# Altium project Electrolux_ENV06_387109600_RevA_PCB.PrjPCB (part 2 of 3)

## Sheet LCD.SchDoc
size A4; DocumentNumber: 5; SheetNumber: 5; SheetTotal: 7
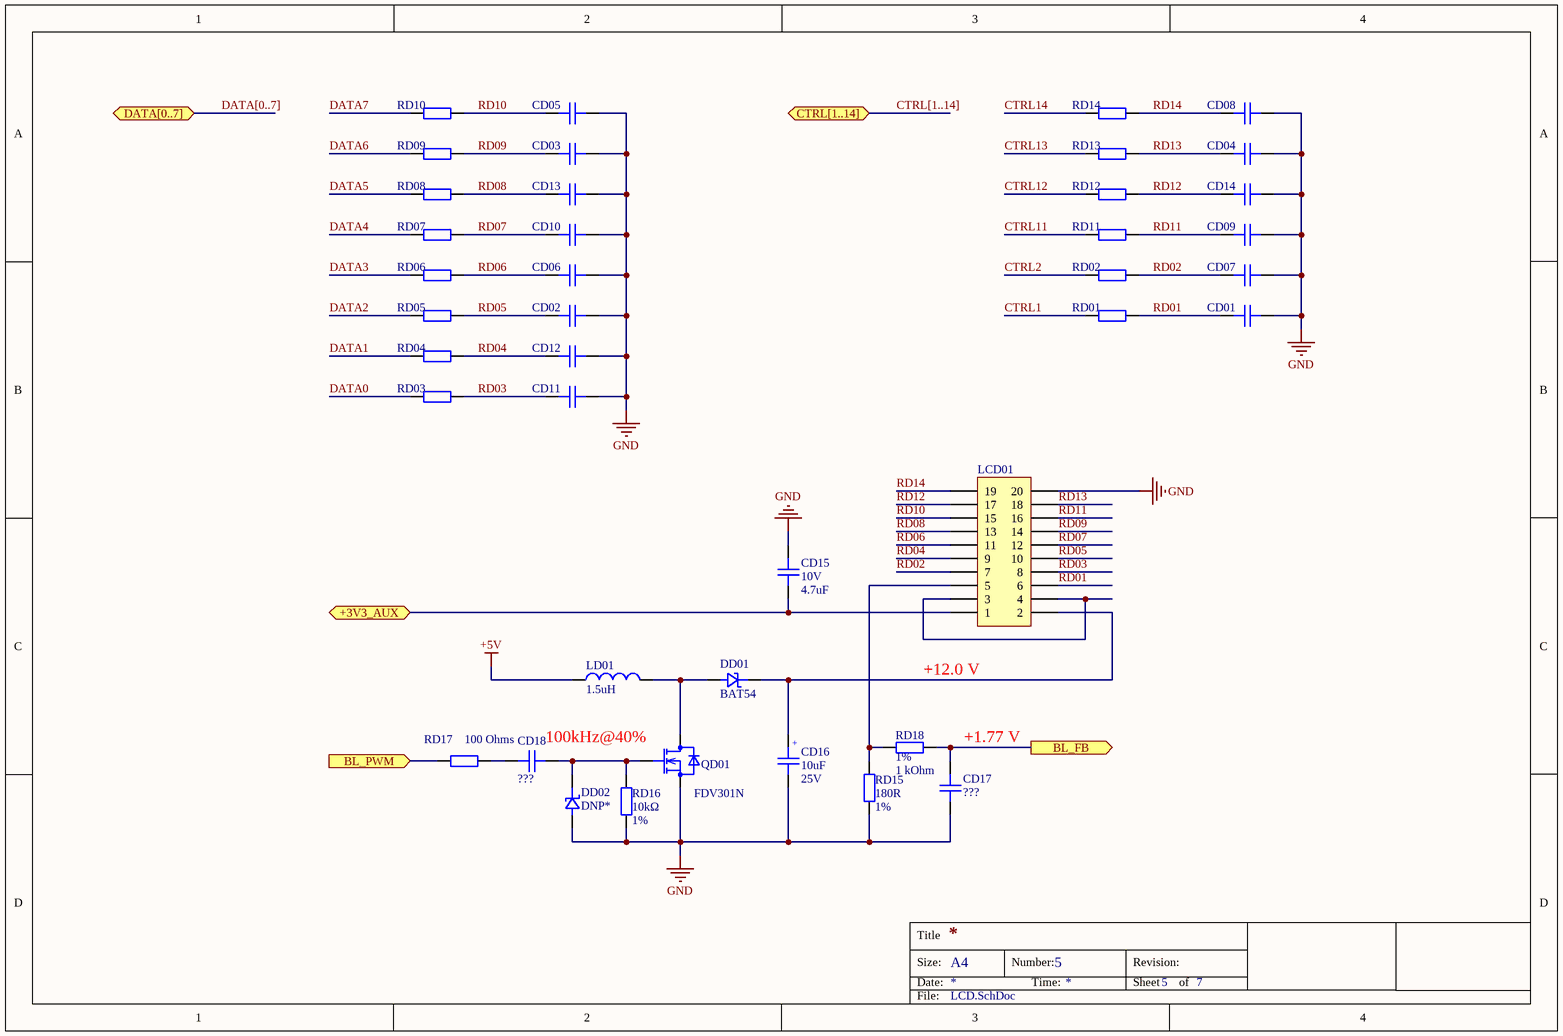
[diagram p3: LCD.SchDoc]

### Parts
CD01  CAP CER 120PF 50V C0G/NP0 0603  [0603C]  (value not drawn)
CD02  CAP CER 120PF 50V C0G/NP0 0603  [0603C]  (value not drawn)
CD03  CAP CER 120PF 50V C0G/NP0 0603  [0603C]  (value not drawn)
CD04  CAP CER 120PF 50V C0G/NP0 0603  [0603C]  (value not drawn)
CD05  CAP CER 120PF 50V C0G/NP0 0603  [0603C]  (value not drawn)
CD06  CAP CER 120PF 50V C0G/NP0 0603  [0603C]  (value not drawn)
CD07  CAP CER 120PF 50V C0G/NP0 0603  [0603C]  (value not drawn)
CD08  CAP CER 120PF 50V C0G/NP0 0603  [0603C]  (value not drawn)
CD09  CAP CER 120PF 50V C0G/NP0 0603  [0603C]  (value not drawn)
CD10  CAP CER 120PF 50V C0G/NP0 0603  [0603C]  (value not drawn)
CD11  CAP CER 120PF 50V C0G/NP0 0603  [0603C]  (value not drawn)
CD12  CAP CER 120PF 50V C0G/NP0 0603  [0603C]  (value not drawn)
CD13  CAP CER 120PF 50V C0G/NP0 0603  [0603C]  (value not drawn)
CD14  CAP CER 120PF 50V C0G/NP0 0603  [0603C]  (value not drawn)
CD15  Voltage Rating: 10V  Capacitance: 4.7uF  [0603C]  (hidden comment: CAP CER 4.7UF 10V X5R 0603)
CD16  Capacitance: 10uF  Rated Voltage: 25V  [WCAP-ASLI_6.3x5.5]  (hidden comment: CAP ALUM 68 UF 20% 25 V SMD)
CD17  Capacitance: ???  [CAPC1608X08N_0603]  (hidden comment: CAP CER 0.1uF ±10% 50V X7R 0603)
CD18  Capacitance: ???  [CAPC1608X08N_0603]  (hidden comment: CAP CER 0.1uF ±10% 50V X7R 0603)
DD01  BAT54  [SOT100P240X120-3N]
DD02  DNP*  [SOT100P240X120-3N]
LCD01  CONN HEADER SMD 20POS 2.54MM  [IDC_2X10 SMD]  (value not drawn)
LD01  Inductance: 1.5uH  (hidden comment: FIXED IND 1.5UH 6.2A 20 MOHM SMD)
QD01  FDV301N  [SOT-23/3]
RD01  100 Ohms  [R_0603]  (value not drawn)
RD02  100 Ohms  [R_0603]  (value not drawn)
RD03  100 Ohms  [R_0603]  (value not drawn)
RD04  100 Ohms  [R_0603]  (value not drawn)
RD05  100 Ohms  [R_0603]  (value not drawn)
RD06  100 Ohms  [R_0603]  (value not drawn)
RD07  100 Ohms  [R_0603]  (value not drawn)
RD08  100 Ohms  [R_0603]  (value not drawn)
RD09  100 Ohms  [R_0603]  (value not drawn)
RD10  100 Ohms  [R_0603]  (value not drawn)
RD11  100 Ohms  [R_0603]  (value not drawn)
RD12  100 Ohms  [R_0603]  (value not drawn)
RD13  100 Ohms  [R_0603]  (value not drawn)
RD14  100 Ohms  [R_0603]  (value not drawn)
RD15  Resistance: 180R  Tolerance: 1%  [Resistor-0603]  (hidden comment: R 180Ω ±5% 0603 0.1W)
RD16  Resistance: 10kΩ  Tolerance: 1%  [R0603]  (hidden comment: RES SMD 10K OHM 1% 1/10W 0603)
RD17  100 Ohms  [R_0603]
RD18  Tolerance: 1%  Resistance: 1 kOhm  [R0603]  (hidden comment: 1 kOhms ±1% 0.1W, 1/10W Chip Resistor 0603 (1608 Metric) Moisture Resistant Thick Film)  (no BOM)

### Ports
+3V3_AUX, BL_FB (out), BL_PWM (in), CTRL[1..14], DATA[0..7]

### Nets
+3V3_AUX: CD15.2 LCD01.1 ; port +3V3_AUX
+5V: LD01.1
GND: CD01.2 CD02.2 CD03.2 CD04.2 CD05.2 CD06.2 CD07.2 CD08.2 CD09.2 CD10.2 CD11.2 CD12.2 CD13.2 CD14.2 CD15.1 CD16.2 CD17.2 DD02.1 LCD01.20 QD01.2(S) RD15.1 RD16.1
CTRL1: RD01.1
CTRL2: RD02.2
CTRL11: RD11.1
CTRL12: RD12.2
CTRL13: RD13.1
CTRL14: RD14.2
DATA0: RD03.1
DATA1: RD04.2
DATA2: RD05.1
DATA3: RD06.2
DATA4: RD07.1
DATA5: RD08.2
DATA6: RD09.1
DATA7: RD10.2
RD01: CD01.1 LCD01.6 RD01.2
RD02: CD07.1 LCD01.7 RD02.1
RD03: CD11.1 LCD01.8 RD03.2
RD04: CD12.1 LCD01.9 RD04.1
RD05: CD02.1 LCD01.10 RD05.2
RD06: CD06.1 LCD01.11 RD06.1
RD07: CD10.1 LCD01.12 RD07.2
RD08: CD13.1 LCD01.13 RD08.1
RD09: CD03.1 LCD01.14 RD09.2
RD10: CD05.1 LCD01.15 RD10.1
RD11: CD09.1 LCD01.16 RD11.2
RD12: CD14.1 LCD01.17 RD12.1
RD13: CD04.1 LCD01.18 RD13.2
RD14: CD08.1 LCD01.19 RD14.1
NetCD16_1: CD16.1 DD01.3 LCD01.2
NetCD17_1: CD17.1 RD18.2 ; port BL_FB
NetCD18_1: CD18.1 DD02.3 QD01.1(G) RD16.2
NetCD18_2: CD18.2 RD17.1
NetDD01_1: DD01.1 LD01.2 QD01.3(D)
NetLCD01_3: LCD01.3 LCD01.4
NetLCD01_5: LCD01.5 RD15.2 RD18.1
NetRD17_2: RD17.2 ; port BL_PWM

### Buses and harness runs
bus CTRL[1..14] = port CTRL[1..14]
bus DATA[0..7] = port DATA[0..7]

### Notes on the sheet
- +12.0 V
- 100kHz@40%
- +1.77 V
- Title
- Size:
- Date:
- A4
- Number:
- Time:
- Revision:
- Sheet
- of
- File:
- (in symbol CAP ALUM 68 UF 20% 25 V SMD) +

### Library data of the parts
CD01 CD02 CD03 CD04 CD05 CD06 CD07 CD08 CD09-CD14 = CAP CER 120PF 50V C0G/NP0 0603: 120pF ±5% 50V Ceramic Capacitor C0G, NP0 0603 (1608 Metric); Manufacturer: KEMET; Manufacturer Part Number: C0603C121J5GACTU; Temperature Coefficient: 30ppm/°C; Dissipation Factor: 0.1%; Supplier 1: Digi-Key; Stock 1: 25376; Pricing 1: 1=0.1, 10=0.061, 100=0.0273, 500=0.0195, 1000=0.0153 (USD); Mount: Surface Mount,PCB; Number of Pins: 2; Case Code (Metric): 1608; Case Code (Imperial): 0603; Dielectric Material: Ceramic; Contact Material: Tin; Contact Plating: Tin,Matte; Min Operating Temperature: -55°C; Max Operating Temperature: 125°C; Tolerance: 5%; Voltage Rating (DC): 50V; Packaging: Tape and Reel; Dielectric: C0G; Termination: SMD/SMT; Voltage Rating: 50V; Package Quantity: 1; Length: 1.6mm; Height: 0.8mm; Width: 0.8mm; Thickness: 0.034inch; Lead Pitch: 0.7mm; Depth: 0.8mm; Radiation Hardening: No; Lead Free: Lead Free; REACH SVHC: No SVHC; ComponentLink1URL: https://www.verical.com/server-webapp/html/getDatasheet?partID=462848&src-supplier=Verical; ComponentLink1Description: https://www.verical.com/server-webapp/html/getDatasheet?partID=462848&src-supplier=Verical; ComponentLink2URL: https://api.kemet.com/component-edge/download/datasheet/C0603C121J5GACTU.pdf?src-supplier=Digi-Key; ComponentLink2Description: https://api.kemet.com/component-edge/download/datasheet/C0603C121J5GACTU.pdf?src-supplier=Digi-Key; ComponentLink3URL: https://www.alliedelec.com/m/d/9bfe7773041ffe9d406e68bc7b377fdd.pdf?src-supplier=Allied+Electronics; ComponentLink3Description: https://www.alliedelec.com/m/d/9bfe7773041ffe9d406e68bc7b377fdd.pdf?src-supplier=Allied+Electronics; ComponentLink4URL: http://www.mouser.com/ds/2/212/KEM_C1003_C0G_SMD-1101588.pdf?src-supplier=Mouser; ComponentLink4Description: http://www.mouser.com/ds/2/212/KEM_C1003_C0G_SMD-1101588.pdf?src-supplier=Mouser; Supplier Part Number 1: 399-1062-1-ND; Case/Package: 0603; Voltage: 50V; Capacitance: 120pF
CD15 = CAP CER 4.7UF 10V X5R 0603: 4.7µF ±10% 10V Ceramic Capacitor X5R 0603 (1608 Metric); Manufacturer: Yageo; Manufacturer Part Number: CC0603KRX5R6BB475; Supplier 1: Digi-Key; Stock 1: 325858; Pricing 1: 1=0.26, 10=0.18, 100=0.102, 500=0.072, 1000=0.063 (USD); Mount: Surface Mount; Case Code (Imperial): 0603; Case Code (Metric): 1608; Min Operating Temperature: -55°C; Max Operating Temperature: 85°C; Voltage Rating (DC): 10V; Tolerance: 10%; Packaging: Tape and Reel; Package Quantity: 1; Dielectric: X5R; Termination: SMD/SMT; Composition: Ceramic; Length: 1.6mm; Height: 0.8mm; Width: 0.8mm; Thickness: 0.035inch; Depth: 0.8mm; Radiation Hardening: No; REACH SVHC: Unknown; Lead Free: Lead Free; Halogen Free: Halogen Free; ComponentLink1URL: http://www.farnell.com/datasheets/2167237.pdf?src-supplier=Element14; ComponentLink1Description: http://www.farnell.com/datasheets/2167237.pdf?src-supplier=Element14; ComponentLink2URL: http://www.yageo.com/documents/recent/UPY-GPHC_X5R_4V-to-50V_25.pdf?src-supplier=Digi-Key; ComponentLink2Description: http://www.yageo.com/documents/recent/UPY-GPHC_X5R_4V-to-50V_25.pdf?src-supplier=Digi-Key; ComponentLink3URL: http://www.yageo.com/documents/recent/UPY-GPHC_X5R_4V-to-50V_12.pdf?src-supplier=Avnet; ComponentLink3Description: http://www.yageo.com/documents/recent/UPY-GPHC_X5R_4V-to-50V_12.pdf?src-supplier=Avnet; ComponentLink4URL: http://www.yageo.com/documents/recent/UPY-GPHC_X5R_4V-to-50V_12.pdf?src-supplier=Avnet+Europe; ComponentLink4Description: http://www.yageo.com/documents/recent/UPY-GPHC_X5R_4V-to-50V_12.pdf?src-supplier=Avnet+Europe; Supplier Part Number 1: 311-1455-1-ND; Case/Package: 0603
CD16 = CAP ALUM 68 UF 20% 25 V SMD: 68µF 25V Aluminum Electrolytic Capacitors Radial, Can - SMD  2000 Hrs @ 105°C; Manufacturer Part Number: 865080443009; Manufacturer: Wurth Elektronik; Dissipation Factor: 14%; Endurance: 2000h; Leakage Current: 17uA; Ripple Current: 240mA; Capacitance Tolerance: +/-20%; Technical Reference: ASED055680M025DVCTBB000; ComponentLink1Description: Manufacturer; ComponentLink1URL: http://www.we-online.de; ComponentLink2Description: Datasheet; ComponentLink2URL: https://www.we-online.com/catalog/datasheet/865080443009.pdf; Height: 5.5mm; Mounting Technology: SMT; Operating Temperature: -55 to +105degC; Packaging: Tape and Reel; Published Date: May 2020; Diameter: 6.3mm; Supplier 1: Digi-Key; Supplier Part Number 1: 732-8437-1-ND
CD17 CD18 = CAP CER 0.1uF ±10% 50V X7R 0603: Capacitor; Manufacturer: KEMET; Manufacturer Part Number: C0603C104M5RACTU; Dielectric Material: Ceramic; Tolerance: 20%; Dissipation Factor: 2.5%; Supplier 1: Digi-Key; Stock 1: 1202175; Pricing 1: 1=0.1, 10=0.039, 50=0.0204, 100=0.0174, 500=0.0124, 1000=0.0097 (USD); Mount: Surface Mount,PCB; Case/Package: 0603; Case Code (Metric): 1608; Case Code (Imperial): 0603; Contact Plating: Tin,Matte; Min Operating Temperature: -55°C; Max Operating Temperature: 125°C; Package Quantity: 1; Packaging: Tape and Reel; Voltage Rating (DC): 50V; Dielectric: X7R; Termination: SMD/SMT; Length: 1.6mm; Height: 0.8mm; Width: 0.031inch; Thickness: 0.034inch; Lead Pitch: 0.7mm; Depth: 0.8mm; Radiation Hardening: No; REACH SVHC: No SVHC; ComponentLink1URL: http://www.farnell.com/datasheets/2746056.pdf?src-supplier=Element14; ComponentLink1Description: http://www.farnell.com/datasheets/2746056.pdf?src-supplier=Element14; ComponentLink2URL: http://www.mouser.com/ds/2/212/KEM_C1002_X7R_SMD-1102033.pdf?src-supplier=Mouser; ComponentLink2Description: http://www.mouser.com/ds/2/212/KEM_C1002_X7R_SMD-1102033.pdf?src-supplier=Mouser; ComponentLink3URL: https://www.verical.com/server-webapp/html/getDatasheet?partID=626892&src-supplier=Verical; ComponentLink3Description: https://www.verical.com/server-webapp/html/getDatasheet?partID=626892&src-supplier=Verical; ComponentLink4URL: http://components.arrow.com/part/dataview/40911037S8853915N7429?src-supplier=Arrow; ComponentLink4Description: http://components.arrow.com/part/dataview/40911037S8853915N7429?src-supplier=Arrow; ComponentLink5URL: http://capacitoredge.kemet.com/capedge2/DataSheet?pn=C0603C104M5RAC7867&src-supplier=Avnet; ComponentLink5Description: http://capacitoredge.kemet.com/capedge2/DataSheet?pn=C0603C104M5RAC7867&src-supplier=Avnet; ComponentLink6URL: http://capacitoredge.kemet.com/capedge2/DataSheet?pn=C0603C104M5RAC7867&src-supplier=Avnet+Asia; ComponentLink6Description: http://capacitoredge.kemet.com/capedge2/DataSheet?pn=C0603C104M5RAC7867&src-supplier=Avnet+Asia; ComponentLink7URL: http://www.farnell.com/datasheets/2746056.pdf?src-supplier=Farnell; ComponentLink7Description: http://www.farnell.com/datasheets/2746056.pdf?src-supplier=Farnell; ComponentLink8URL: http://www.farnell.com/datasheets/2746056.pdf?src-supplier=Newark; ComponentLink8Description: http://www.farnell.com/datasheets/2746056.pdf?src-supplier=Newark; ComponentLink9URL: http://www.alliedelec.com/m/d/6f3b5eb83d09db50ed28bdc730567b33.pdf?src-supplier=Allied+Electronics; ComponentLink9Description: http://www.alliedelec.com/m/d/6f3b5eb83d09db50ed28bdc730567b33.pdf?src-supplier=Allied+Electronics; ComponentLink10URL: https://api.kemet.com/component-edge/download/datasheet/C0603C104M5RACTU.pdf?src-supplier=Digi-Key; ComponentLink10Description: https://api.kemet.com/component-edge/download/datasheet/C0603C104M5RACTU.pdf?src-supplier=Digi-Key; ComponentLink11URL: http://www.farnell.com/datasheets/2315113.pdf?src-supplier=Newark; ComponentLink11Description: http://www.farnell.com/datasheets/2315113.pdf?src-supplier=Newark; ComponentLink12URL: http://www.farnell.com/datasheets/1828800.pdf?src-supplier=Newark; ComponentLink12Description: http://www.farnell.com/datasheets/1828800.pdf?src-supplier=Newark; ComponentLink13URL: http://components.arrow.com/part/dataview/0323_00313986?src-supplier=Arrow+Europe; ComponentLink13Description: http://components.arrow.com/part/dataview/0323_00313986?src-supplier=Arrow+Europe; ComponentLink14URL: https://www.verical.com/server-webapp/html/getDatasheet?partID=110138&src-supplier=Verical; ComponentLink14Description: https://www.verical.com/server-webapp/html/getDatasheet?partID=110138&src-supplier=Verical; Supplier Part Number 1: 399-7845-1-ND; Voltage Rating: 50V
DD01 DD02 = BAT54: Schottky DiodeS
LCD01 = CONN HEADER SMD 20POS 2.54MM: Connector Header Surface Mount 20 position 0.100" (2.54mm); Manufacturer: CNC Tech; Manufacturer Part Number: 3020-20-0300-00; Number of Positions: 20; Connector Type: Male Pin; Pitch: 0.1inch; Supplier 1: Digi-Key; Stock 1: 575; Pricing 1: 1=0.81, 10=0.714, 100=0.616, 500=0.504, 1000=0.448, 5000=0.392, 10000=0.3724 (USD); Mount: Surface Mount; Contact Plating: Gold; Package Quantity: 960; Number of Rows: 2; Packaging: Tray; Termination: Solder; Row Spacing: 0.1inch; ComponentLink1URL: http://cnctech.us/idcmatching2.pdf?src-supplier=Digi-Key; ComponentLink1Description: http://cnctech.us/idcmatching2.pdf?src-supplier=Digi-Key; Supplier Part Number 1: 1175-1623-ND
LD01 = FIXED IND 1.5UH 6.2A 20 MOHM SMD: 1.5µH Shielded Molded Inductor 6.2A 20mOhm Max Nonstandard; Manufacturer: Wurth Electronics; Manufacturer Part Number: 74438357015; Core Material: Metal,Composite; Tolerance: 20%; Saturation Current: 8.5A; DC Resistance (DCR): 20mR; Self Resonant Frequency: 48MHz; Test Frequency: 100kHz; Supplier 1: Digi-Key; Stock 1: 2769; Pricing 1: 1=1.58, 10=1.507, 50=1.452, 100=1.32 (USD); Mount: Surface Mount; Case/Package: Nonstandard; Min Operating Temperature: -40°C; Max Operating Temperature: 125°C; Packaging: Tape and Reel; Current Rating: 6.2A; Shielding: Shielded; ComponentLink1URL: http://www.farnell.com/datasheets/2579567.pdf?src-supplier=Farnell; ComponentLink1Description: http://www.farnell.com/datasheets/2579567.pdf?src-supplier=Farnell; ComponentLink2URL: http://www.farnell.com/datasheets/2579567.pdf?src-supplier=Newark; ComponentLink2Description: http://www.farnell.com/datasheets/2579567.pdf?src-supplier=Newark; ComponentLink3URL: https://katalog.we-online.de/pbs/datasheet/74438357015.pdf?src-supplier=Digi-Key; ComponentLink3Description: https://katalog.we-online.de/pbs/datasheet/74438357015.pdf?src-supplier=Digi-Key; Supplier Part Number 1: 732-11199-1-ND
QD01 = MOSFET FDV301N N-CH 25V 220MA SOT23: N-Channel 25 V 220mA (Ta) 350mW (Ta) Surface Mount SOT-23-3
RD01 RD02 RD03 RD04 RD05 RD06 RD07 RD08 RD09-RD14 RD17 = RES_SMD_100_OHM_1%_1/8W_0603: RES SMD 100 OHM 1% 1/8W 0603; PartNumber: MCT06030C1000FP500; Manufacturer: Vishay Beyschlag; Link: https://www.digikey.com/product-detail/en/vishay-beyschlag/MCT06030C1000FP500/MCT0603-100-CFCT-ND/2607874; Digi-KeyPartNumber: MCT0603-100-CFCT-ND; Value: 100 Ohms
RD15 = R 180Ω ±5% 0603 0.1W: Resistor; Manufacturer: Stackpole Electronics; Manufacturer Part Number: RMCF0603FT180R; Max Power Dissipation: 100mW; Temperature Coefficient: 100ppm/°C; Supplier 1: Digi-Key; Stock 1: 93001; Pricing 1: 1=0.1, 10=0.016, 100=0.0065, 1000=0.0029, 2500=0.0025 (USD); Mount: Surface Mount; Case/Package: 0603; Case Code (Metric): 1608; Case Code (Imperial): 0603; Contact Plating: Tin,Matte; Min Operating Temperature: -55°C; Max Operating Temperature: 155°C; Packaging: Tape and Reel; Composition: Thick Film; Number of Terminations: 2; Features: Automotive AEC-Q200; Length: 0.061inch; Height: 0.022inch; Width: 0.031inch; Radiation Hardening: No; ComponentLink1URL: https://www.seielect.com/Catalog/SEI-RMCF_RMCP.pdf?src-supplier=Digi-Key; ComponentLink1Description: https://www.seielect.com/Catalog/SEI-RMCF_RMCP.pdf?src-supplier=Digi-Key; ComponentLink2URL: https://www.seielect.com/catalog/SEI-Packaging.pdf?src-supplier=Digi-Key; ComponentLink2Description: https://www.seielect.com/catalog/SEI-Packaging.pdf?src-supplier=Digi-Key; ComponentLink3URL: https://www.seielect.com/catalog/SEI-RMCF_RMCP.pdf?src-supplier=Avnet; ComponentLink3Description: https://www.seielect.com/catalog/SEI-RMCF_RMCP.pdf?src-supplier=Avnet; Supplier Part Number 1: RMCF0603FT180RCT-ND
RD16 = RES SMD 10K OHM 1% 1/10W 0603: 10 kOhms ±1% 0.1W, 1/10W Chip Resistor 0603 (1608 Metric)  Thick Film; Manufacturer: Yageo; Manufacturer Part Number: RC0603FR-0710KL; Temperature Coefficient: 100ppm/°C; Voltage Rating: 75V; Power Rating: 100mW; Voltage Rating (DC): 50V; Supplier 1: Digi-Key; Stock 1: 81498627; Pricing 1: 1=0.1, 10=0.024, 100=0.0097, 1000=0.0044, 2500=0.0038 (USD); Case/Package: 0603; Number of Pins: 2; Weight: 7.1E-05oz; Case Code (Imperial): 0603; Case Code (Metric): 1608; Min Operating Temperature: -55°C; Max Operating Temperature: 155°C; Packaging: Tape and Reel; Composition: Thick Film; Military Standard: Not; Termination: SMD/SMT; Length: 1.6mm; Height: 0.45mm; Width: 0.8mm; Depth: 0.8mm; Lead Pitch: 0.3mm; Lead Free: Lead Free; REACH SVHC: No SVHC; ComponentLink1URL: http://www.farnell.com/datasheets/38590.pdf?src-supplier=Element14; ComponentLink1Description: http://www.farnell.com/datasheets/38590.pdf?src-supplier=Element14; ComponentLink2URL: https://www.verical.com/server-webapp/html/getDatasheet?partID=409289&src-supplier=Verical; ComponentLink2Description: https://www.verical.com/server-webapp/html/getDatasheet?partID=409289&src-supplier=Verical; ComponentLink3URL: http://www.farnell.com/datasheets/1868787.pdf?src-supplier=Element14; ComponentLink3Description: http://www.farnell.com/datasheets/1868787.pdf?src-supplier=Element14; ComponentLink4URL: http://www.farnell.com/datasheets/2167052.pdf?src-supplier=Element14; ComponentLink4Description: http://www.farnell.com/datasheets/2167052.pdf?src-supplier=Element14; ComponentLink5URL: http://www.farnell.com/datasheets/443971.pdf?src-supplier=Element14; ComponentLink5Description: http://www.farnell.com/datasheets/443971.pdf?src-supplier=Element14; Supplier Part Number 1: 311-10.0KHRCT-ND
RD18 = RES SMD 1K OHM 1% 1/10W 0603: Manufacturer: Yageo; Manufacturer Part Number: RC0603FR-071KL; Temperature Coefficient: 100ppm/°C; Power Rating: 100mW; Voltage Rating: 50V; Supplier 1: Digi-Key; Stock 1: 39344753; Pricing 1: 1=0.1, 10=0.023, 100=0.0094, 1000=0.0042, 2500=0.0037 (USD); Contact Plating: Tin,Matte; Case Code (Imperial): 0603; Case Code (Metric): 1608; Min Operating Temperature: -55°C; Max Operating Temperature: 155°C; Composition: Thick Film; Packaging: Tape and Reel; Termination: SMD/SMT; Military Standard: Not; Length: 1.6mm; Height: 0.45mm; Depth: 0.8mm; Radiation Hardening: No; REACH SVHC: No SVHC; Lead Free: Lead Free; ComponentLink1URL: http://documents.rs-components.com/techlib://itc_doclist_GB.htm?stockno=5048928&src-supplier=RSComponents; ComponentLink1Description: http://documents.rs-components.com/techlib://itc_doclist_GB.htm?stockno=5048928&src-supplier=RSComponents; ComponentLink2URL: http://www.yageo.com/documents/recent/PYu-RC0603_51_RoHS_L_4.pdf?src-supplier=Avnet+Europe; ComponentLink2Description: http://www.yageo.com/documents/recent/PYu-RC0603_51_RoHS_L_4.pdf?src-supplier=Avnet+Europe; ComponentLink3URL: http://www.farnell.com/datasheets/2167052.pdf?src-supplier=Element14; ComponentLink3Description: http://www.farnell.com/datasheets/2167052.pdf?src-supplier=Element14; ComponentLink4URL: http://www.farnell.com/datasheets/1868787.pdf?src-supplier=Element14; ComponentLink4Description: http://www.farnell.com/datasheets/1868787.pdf?src-supplier=Element14; ComponentLink5URL: http://www.yageo.com/documents/recent/PYu-RC_Group_51_RoHS_L_2.pdf?src-supplier=Avnet; ComponentLink5Description: http://www.yageo.com/documents/recent/PYu-RC_Group_51_RoHS_L_2.pdf?src-supplier=Avnet; ComponentLink6URL: https://www.verical.com/server-webapp/html/getDatasheet?partID=404327&src-supplier=Verical; ComponentLink6Description: https://www.verical.com/server-webapp/html/getDatasheet?partID=404327&src-supplier=Verical; ComponentLink7URL: http://www.farnell.com/datasheets/443971.pdf?src-supplier=Element14; ComponentLink7Description: http://www.farnell.com/datasheets/443971.pdf?src-supplier=Element14; Supplier Part Number 1: 311-1.00KHRDKR-ND; Case/Package: 0603

## Sheet KeypadConnection.SchDoc
size A4; DocumentNumber: 4; SheetNumber: 4; SheetTotal: 7
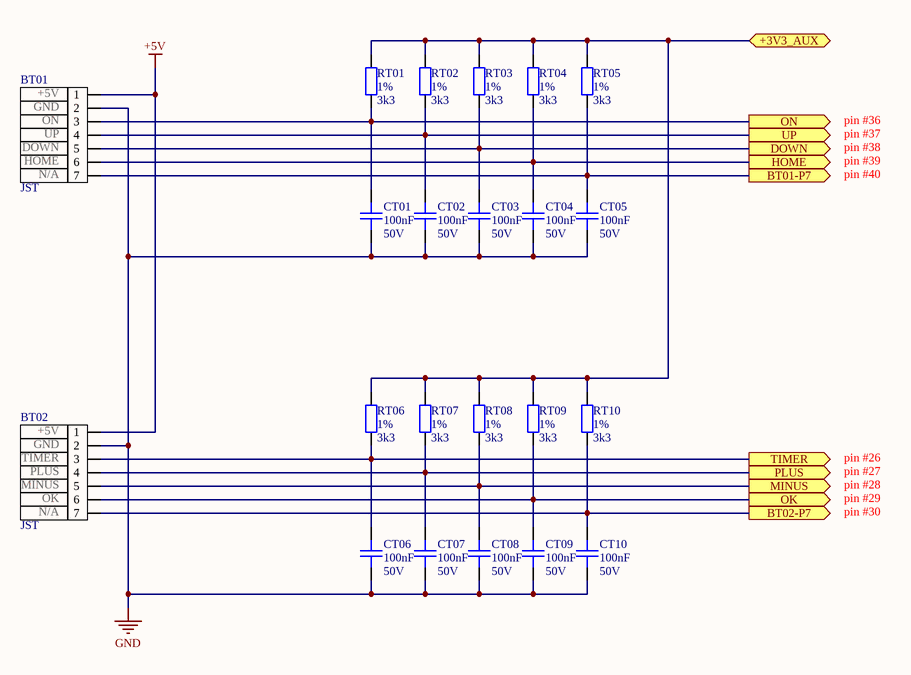
[diagram p4: KeypadConnection.SchDoc]

### Parts
BT01  JST  pin_1: +5V  pin_2: GND  pin_3: ON  pin_4: UP  pin_5: DOWN  pin_6: HOME
BT02  JST  pin_1: +5V  pin_2: GND  pin_3: TIMER  pin_4: PLUS  pin_5: MINUS  pin_6: OK
CT01  Capacitance: 100nF  Voltage Rating: 50V  [CAPC1608X08N_0603]  (hidden comment: CAP CER 0.1uF ±10% 50V X7R 0603)
CT02  Capacitance: 100nF  Voltage Rating: 50V  [CAPC1608X08N_0603]  (hidden comment: CAP CER 0.1uF ±10% 50V X7R 0603)
CT03  Capacitance: 100nF  Voltage Rating: 50V  [CAPC1608X08N_0603]  (hidden comment: CAP CER 0.1uF ±10% 50V X7R 0603)
CT04  Capacitance: 100nF  Voltage Rating: 50V  [CAPC1608X08N_0603]  (hidden comment: CAP CER 0.1uF ±10% 50V X7R 0603)
CT05  Capacitance: 100nF  Voltage Rating: 50V  [CAPC1608X08N_0603]  (hidden comment: CAP CER 0.1uF ±10% 50V X7R 0603)
CT06  Capacitance: 100nF  Voltage Rating: 50V  [CAPC1608X08N_0603]  (hidden comment: CAP CER 0.1uF ±10% 50V X7R 0603)
CT07  Capacitance: 100nF  Voltage Rating: 50V  [CAPC1608X08N_0603]  (hidden comment: CAP CER 0.1uF ±10% 50V X7R 0603)
CT08  Capacitance: 100nF  Voltage Rating: 50V  [CAPC1608X08N_0603]  (hidden comment: CAP CER 0.1uF ±10% 50V X7R 0603)
CT09  Capacitance: 100nF  Voltage Rating: 50V  [CAPC1608X08N_0603]  (hidden comment: CAP CER 0.1uF ±10% 50V X7R 0603)
CT10  Capacitance: 100nF  Voltage Rating: 50V  [CAPC1608X08N_0603]  (hidden comment: CAP CER 0.1uF ±10% 50V X7R 0603)
RT01  Tolerance: 1%  Resistance: 3k3  [Resistor-0603]  (hidden comment: R 3kΩ ±1% 0603 0.1W)
RT02  Tolerance: 1%  Resistance: 3k3  [Resistor-0603]  (hidden comment: R 3kΩ ±1% 0603 0.1W)
RT03  Tolerance: 1%  Resistance: 3k3  [Resistor-0603]  (hidden comment: R 3kΩ ±1% 0603 0.1W)
RT04  Tolerance: 1%  Resistance: 3k3  [Resistor-0603]  (hidden comment: R 3kΩ ±1% 0603 0.1W)
RT05  Tolerance: 1%  Resistance: 3k3  [Resistor-0603]  (hidden comment: R 3kΩ ±1% 0603 0.1W)
RT06  Tolerance: 1%  Resistance: 3k3  [Resistor-0603]  (hidden comment: R 3kΩ ±1% 0603 0.1W)
RT07  Tolerance: 1%  Resistance: 3k3  [Resistor-0603]  (hidden comment: R 3kΩ ±1% 0603 0.1W)
RT08  Tolerance: 1%  Resistance: 3k3  [Resistor-0603]  (hidden comment: R 3kΩ ±1% 0603 0.1W)
RT09  Tolerance: 1%  Resistance: 3k3  [Resistor-0603]  (hidden comment: R 3kΩ ±1% 0603 0.1W)
RT10  Tolerance: 1%  Resistance: 3k3  [Resistor-0603]  (hidden comment: R 3kΩ ±1% 0603 0.1W)

### Ports
+3V3_AUX, BT01-P7 (out), BT02-P7 (out), DOWN (out), HOME (out), MINUS (out), OK (out), ON (out), PLUS (out), TIMER (out), UP (out)

### Nets
+3V3_AUX: RT01.2 RT02.2 RT03.2 RT04.2 RT05.2 RT06.2 RT07.2 RT08.2 RT09.2 RT10.2 ; port +3V3_AUX
+5V: BT01.1 BT02.1
GND: BT01.2 BT02.2 CT01.1 CT02.1 CT03.1 CT04.1 CT05.1 CT06.1 CT07.1 CT08.1 CT09.1 CT10.1
NetBT01_3: BT01.3 CT01.2 RT01.1 ; port ON
NetBT01_4: BT01.4 CT02.2 RT02.1 ; port UP
NetBT01_5: BT01.5 CT03.2 RT03.1 ; port DOWN
NetBT01_6: BT01.6 CT04.2 RT04.1 ; port HOME
NetBT01_7: BT01.7 CT05.2 RT05.1 ; port BT01-P7
NetBT02_3: BT02.3 CT06.2 RT06.1 ; port TIMER
NetBT02_4: BT02.4 CT07.2 RT07.1 ; port PLUS
NetBT02_5: BT02.5 CT08.2 RT08.1 ; port MINUS
NetBT02_6: BT02.6 CT09.2 RT09.1 ; port OK
NetBT02_7: BT02.7 CT10.2 RT10.1 ; port BT02-P7

### Notes on the sheet
- pin #38
- pin #37
- pin #36
- pin #40
- pin #39
- pin #26
- pin #27
- pin #28
- pin #29
- pin #30
- Title
- Size:
- Date:
- A4
- Number:
- Time:
- Revision:
- Sheet
- of
- File:

### Library data of the parts
BT01 BT02 = CONN FFC 7POS 1MM: pin_7: N/A
CT01 CT02 CT03 CT04 CT05 CT06 CT07 CT08 CT09 CT10 = CAP CER 0.1uF ±10% 50V X7R 0603: as CD17 on sheet LCD; Supplier 1: Digi-Key; Stock 1: 1202175; Pricing 1: 1=0.1, 10=0.039, 50=0.0204, 100=0.0174, 500=0.0124, 1000=0.0097 (USD); Mount: Surface Mount,PCB; Case/Package: 0603; Case Code (Metric): 1608; Case Code (Imperial): 0603; Contact Plating: Tin,Matte; Min Operating Temperature: -55°C; Max Operating Temperature: 125°C; Package Quantity: 1; Packaging: Tape and Reel; Voltage Rating (DC): 50V; Dielectric: X7R; Termination: SMD/SMT; Length: 1.6mm; Height: 0.8mm; Width: 0.031inch; Thickness: 0.034inch; Lead Pitch: 0.7mm; Depth: 0.8mm; Radiation Hardening: No; REACH SVHC: No SVHC; ComponentLink1URL: http://www.farnell.com/datasheets/2746056.pdf?src-supplier=Element14; ComponentLink1Description: http://www.farnell.com/datasheets/2746056.pdf?src-supplier=Element14; ComponentLink2URL: http://www.mouser.com/ds/2/212/KEM_C1002_X7R_SMD-1102033.pdf?src-supplier=Mouser; ComponentLink2Description: http://www.mouser.com/ds/2/212/KEM_C1002_X7R_SMD-1102033.pdf?src-supplier=Mouser; ComponentLink3URL: https://www.verical.com/server-webapp/html/getDatasheet?partID=626892&src-supplier=Verical; ComponentLink3Description: https://www.verical.com/server-webapp/html/getDatasheet?partID=626892&src-supplier=Verical; ComponentLink4URL: http://components.arrow.com/part/dataview/40911037S8853915N7429?src-supplier=Arrow; ComponentLink4Description: http://components.arrow.com/part/dataview/40911037S8853915N7429?src-supplier=Arrow; ComponentLink5URL: http://capacitoredge.kemet.com/capedge2/DataSheet?pn=C0603C104M5RAC7867&src-supplier=Avnet; ComponentLink5Description: http://capacitoredge.kemet.com/capedge2/DataSheet?pn=C0603C104M5RAC7867&src-supplier=Avnet; ComponentLink6URL: http://capacitoredge.kemet.com/capedge2/DataSheet?pn=C0603C104M5RAC7867&src-supplier=Avnet+Asia; ComponentLink6Description: http://capacitoredge.kemet.com/capedge2/DataSheet?pn=C0603C104M5RAC7867&src-supplier=Avnet+Asia; ComponentLink7URL: http://www.farnell.com/datasheets/2746056.pdf?src-supplier=Farnell; ComponentLink7Description: http://www.farnell.com/datasheets/2746056.pdf?src-supplier=Farnell; ComponentLink8URL: http://www.farnell.com/datasheets/2746056.pdf?src-supplier=Newark; ComponentLink8Description: http://www.farnell.com/datasheets/2746056.pdf?src-supplier=Newark; ComponentLink9URL: http://www.alliedelec.com/m/d/6f3b5eb83d09db50ed28bdc730567b33.pdf?src-supplier=Allied+Electronics; ComponentLink9Description: http://www.alliedelec.com/m/d/6f3b5eb83d09db50ed28bdc730567b33.pdf?src-supplier=Allied+Electronics; ComponentLink10URL: https://api.kemet.com/component-edge/download/datasheet/C0603C104M5RACTU.pdf?src-supplier=Digi-Key; ComponentLink10Description: https://api.kemet.com/component-edge/download/datasheet/C0603C104M5RACTU.pdf?src-supplier=Digi-Key; ComponentLink11URL: http://www.farnell.com/datasheets/2315113.pdf?src-supplier=Newark; ComponentLink11Description: http://www.farnell.com/datasheets/2315113.pdf?src-supplier=Newark; ComponentLink12URL: http://www.farnell.com/datasheets/1828800.pdf?src-supplier=Newark; ComponentLink12Description: http://www.farnell.com/datasheets/1828800.pdf?src-supplier=Newark; ComponentLink13URL: http://components.arrow.com/part/dataview/0323_00313986?src-supplier=Arrow+Europe; ComponentLink13Description: http://components.arrow.com/part/dataview/0323_00313986?src-supplier=Arrow+Europe; ComponentLink14URL: https://www.verical.com/server-webapp/html/getDatasheet?partID=110138&src-supplier=Verical; ComponentLink14Description: https://www.verical.com/server-webapp/html/getDatasheet?partID=110138&src-supplier=Verical; Supplier Part Number 1: 399-7845-1-ND
RT01 RT02 RT03 RT04 RT05 RT06 RT07 RT08 RT09 RT10 = R 3kΩ ±1% 0603 0.1W: Resistor; Manufacturer: Yageo; Manufacturer Part Number: RC0603FR-073KL; Temperature Coefficient: 100ppm/°C; Power Rating: 100mW; Voltage Rating: 50V; Supplier 1: Digi-Key; Stock 1: 3150938; Pricing 1: 1=0.1, 10=0.024, 100=0.0097, 1000=0.0044, 2500=0.0038 (USD); Case/Package: 0603; Number of Pins: 2; Case Code (Imperial): 0603; Case Code (Metric): 1608; Min Operating Temperature: -55°C; Max Operating Temperature: 155°C; Packaging: Tape and Reel; Composition: Thick Film; Termination: SMD/SMT; Voltage Rating (DC): 50V; Military Standard: Not; Length: 1.6mm; Width: 800um; Depth: 0.8mm; Lead Free: Lead Free; REACH SVHC: No SVHC; Supplier Part Number 1: 311-3.00KHRCT-ND

## Sheet RTC.SchDoc
size A4; DocumentNumber: 7; SheetNumber: 7; SheetTotal: 7
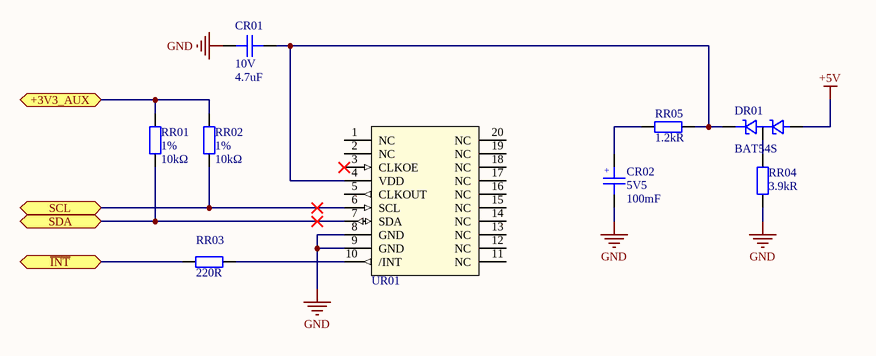
[diagram p5: RTC.SchDoc]

### Parts
CR01  Voltage Rating: 10V  Capacitance: 4.7uF  [0603C]  (hidden comment: CAP CER 4.7UF 10V X5R 0603)
CR02  Voltage Rating: 5V5  Capacitance: 100mF  [WCAP-ASLI_5x5.5]  (hidden comment: CAP ALUM 100 UF 20% 6.3 V SMD)
DR01  BAT54S
RR01  Tolerance: 1%  Resistance: 10kΩ  [R0603]  (hidden comment: 10 kOhms ±1% 0.1W, 1/10W Chip Resistor 0603 (1608 Metric)  Thick Film)
RR02  Tolerance: 1%  Resistance: 10kΩ  [R0603]  (hidden comment: 10 kOhms ±1% 0.1W, 1/10W Chip Resistor 0603 (1608 Metric)  Thick Film)
RR03  Resistance: 220R  [Resistor-0603]  (hidden comment: R 220Ω ±1% 0603 0.1W)
RR04  Resistance: 3.9kR  [Resistor-0603]  (hidden comment: R 3kΩ ±1% 0603 0.1W)
RR05  Resistance: 1.2kR  [R0402]  (hidden comment: RES SMD 1.2K OHM 1% 1/16W 0402)
UR01  IC RTC-8564JE RTC CLK/CALENDAR I2C 20-VSOJ  (value not drawn)

### Ports
+3V3_AUX, SCL, SDA, ~{INT}

### Nets
+3V3_AUX: RR01.2 RR02.2 ; port +3V3_AUX
+5V: DR01.1
GND: CR01.2 CR02.2 RR04.2 UR01.8(GND) UR01.9(GND)
IRQ: RR03.1 ; port ~{INT}
NetCR01_1: CR01.1 DR01.2 RR05.1 UR01.4(VDD)
NetCR02_1: CR02.1 RR05.2
NetDR01_3: DR01.3 RR04.1
NetRR01_1: RR01.1 UR01.7(SDA) ; port SDA
NetRR02_1: RR02.1 UR01.6(SCL) ; port SCL
NetRR03_2: RR03.2 UR01.10(/INT)

Not connected (* = marked no-connect by the designer): UR01 1(NC) 2(NC) 3(CLKOE)* 5(CLKOUT) 11(NC) 12(NC) 13(NC) 14(NC) 15(NC) 16(NC) 17(NC) 18(NC) 19(NC) 20(NC)

### Notes on the sheet
- Title
- Size:
- Date:
- A4
- Number:
- Time:
- Revision:
- Sheet
- of
- File:
- (in symbol CAP ALUM 100 UF 20% 6.3 V SMD) +

### Library data of the parts
CR01 = CAP CER 4.7UF 10V X5R 0603: as CD15 on sheet LCD; Supplier 1: Digi-Key; Stock 1: 325858; Pricing 1: 1=0.26, 10=0.18, 100=0.102, 500=0.072, 1000=0.063 (USD); Mount: Surface Mount; Case Code (Imperial): 0603; Case Code (Metric): 1608; Min Operating Temperature: -55°C; Max Operating Temperature: 85°C; Voltage Rating (DC): 10V; Tolerance: 10%; Packaging: Tape and Reel; Package Quantity: 1; Dielectric: X5R; Termination: SMD/SMT; Composition: Ceramic; Length: 1.6mm; Height: 0.8mm; Width: 0.8mm; Thickness: 0.035inch; Depth: 0.8mm; Radiation Hardening: No; REACH SVHC: Unknown; Lead Free: Lead Free; Halogen Free: Halogen Free; ComponentLink1URL: http://www.farnell.com/datasheets/2167237.pdf?src-supplier=Element14; ComponentLink1Description: http://www.farnell.com/datasheets/2167237.pdf?src-supplier=Element14; ComponentLink2URL: http://www.yageo.com/documents/recent/UPY-GPHC_X5R_4V-to-50V_25.pdf?src-supplier=Digi-Key; ComponentLink2Description: http://www.yageo.com/documents/recent/UPY-GPHC_X5R_4V-to-50V_25.pdf?src-supplier=Digi-Key; ComponentLink3URL: http://www.yageo.com/documents/recent/UPY-GPHC_X5R_4V-to-50V_12.pdf?src-supplier=Avnet; ComponentLink3Description: http://www.yageo.com/documents/recent/UPY-GPHC_X5R_4V-to-50V_12.pdf?src-supplier=Avnet; ComponentLink4URL: http://www.yageo.com/documents/recent/UPY-GPHC_X5R_4V-to-50V_12.pdf?src-supplier=Avnet+Europe; ComponentLink4Description: http://www.yageo.com/documents/recent/UPY-GPHC_X5R_4V-to-50V_12.pdf?src-supplier=Avnet+Europe; Supplier Part Number 1: 311-1455-1-ND; Case/Package: 0603
CR02 = CAP ALUM 100 UF 20% 6.3 V SMD: 100µF 6.3V Aluminum Electrolytic Capacitors Radial, Can - SMD  2000 Hrs @ 105°C; Manufacturer Part Number: 865080142007; Manufacturer: Wurth Elektronik; Dissipation Factor: 24%; Endurance: 2000h; Leakage Current: 6.3uA; Ripple Current: 170mA; Capacitance Tolerance: +/-20%; Technical Reference: ASEC055101M6R3DVCTBB000; Polarity: Polar; Impedance: 800mR; Life (Hours): 2000Hour; ComponentLink1Description: Manufacturer; ComponentLink1URL: http://www.we-online.de; ComponentLink2Description: Datasheet; ComponentLink2URL: https://www.we-online.com/catalog/datasheet/865080142007.pdf; Height: 5.5mm; Mounting Technology: SMT; Operating Temperature: -55 to +105degC; Packaging: Tape and Reel; Published Date: May 2020; Diameter: 5mm; Supplier 1: Digi-Key; Stock 1: 2227; Pricing 1: 1=0.2, 50=0.167, 100=0.145, 250=0.129, 500=0.113 (USD); Mount: Surface Mount; Case/Package: Radial; Min Operating Temperature: -55°C; Max Operating Temperature: 105°C; Package Quantity: 1000; Ripple Current (AC): 170mA; Tolerance: 20%; Voltage Rating (DC): 6.3V; Height - Seated (Max): 0.217inch; REACH SVHC: Unknown; ComponentLink3URL: http://www.farnell.com/datasheets/1880090.pdf?src-supplier=Farnell; ComponentLink3Description: http://www.farnell.com/datasheets/1880090.pdf?src-supplier=Farnell; ComponentLink4URL: http://www.farnell.com/datasheets/1880090.pdf?src-supplier=Newark; ComponentLink4Description: http://www.farnell.com/datasheets/1880090.pdf?src-supplier=Newark; ComponentLink5URL: http://katalog.we-online.de/pbs/datasheet/865080142007.pdf?src-supplier=Digi-Key; ComponentLink5Description: http://katalog.we-online.de/pbs/datasheet/865080142007.pdf?src-supplier=Digi-Key; ComponentLink6URL: http://www.farnell.com/datasheets/1880090.pdf?src-supplier=Element14; ComponentLink6Description: http://www.farnell.com/datasheets/1880090.pdf?src-supplier=Element14; ComponentLink7URL: https://katalog.we-online.de/pbs/datasheet/865080142007.pdf?src-supplier=Digi-Key; ComponentLink7Description: https://katalog.we-online.de/pbs/datasheet/865080142007.pdf?src-supplier=Digi-Key; Supplier Part Number 1: 732-8472-1-ND
DR01 = BAT54S: Schottky DiodeS
RR01 RR02 = RES SMD 10K OHM 1% 1/10W 0603: Manufacturer: Yageo; Manufacturer Part Number: RC0603FR-0710KL; Temperature Coefficient: 100ppm/°C; Power Rating: 100mW; Voltage Rating: 75V; Voltage Rating (DC): 50V; Supplier 1: Digi-Key; Stock 1: 81498627; Pricing 1: 1=0.1, 10=0.024, 100=0.0097, 1000=0.0044, 2500=0.0038 (USD); Case Code (Imperial): 0603; Case Code (Metric): 1608; Min Operating Temperature: -55°C; Max Operating Temperature: 155°C; Composition: Thick Film; Packaging: Tape and Reel; Termination: SMD/SMT; Military Standard: Not; Length: 1.6mm; Height: 0.45mm; Depth: 0.8mm; REACH SVHC: No SVHC; Lead Free: Lead Free; ComponentLink1URL: http://www.farnell.com/datasheets/38590.pdf?src-supplier=Element14; ComponentLink1Description: http://www.farnell.com/datasheets/38590.pdf?src-supplier=Element14; ComponentLink2URL: https://www.verical.com/server-webapp/html/getDatasheet?partID=409289&src-supplier=Verical; ComponentLink2Description: https://www.verical.com/server-webapp/html/getDatasheet?partID=409289&src-supplier=Verical; ComponentLink3URL: http://www.farnell.com/datasheets/1868787.pdf?src-supplier=Element14; ComponentLink3Description: http://www.farnell.com/datasheets/1868787.pdf?src-supplier=Element14; ComponentLink4URL: http://www.farnell.com/datasheets/2167052.pdf?src-supplier=Element14; ComponentLink4Description: http://www.farnell.com/datasheets/2167052.pdf?src-supplier=Element14; ComponentLink5URL: http://www.farnell.com/datasheets/443971.pdf?src-supplier=Element14; ComponentLink5Description: http://www.farnell.com/datasheets/443971.pdf?src-supplier=Element14; Supplier Part Number 1: 311-10.0KHRCT-ND; Case/Package: 0603; Number of Pins: 2; Weight: 7.1E-05oz; Width: 0.8mm; Lead Pitch: 0.3mm
RR03 = R 220Ω ±1% 0603 0.1W: Resistor; Manufacturer: Stackpole Electronics; Manufacturer Part Number: RMCF0603FT220R; Power Rating: 100mW; Temperature Coefficient: 100ppm/°C; Supplier 1: Digi-Key; Stock 1: 79747; Pricing 1: 1=0.1, 10=0.016, 100=0.0065, 1000=0.0029, 2500=0.0025 (USD); Mount: Surface Mount; Case/Package: 0603; Case Code (Metric): 1608; Case Code (Imperial): 0603; Contact Plating: Tin,Matte; Min Operating Temperature: -55°C; Max Operating Temperature: 155°C; Packaging: Tape and Reel; Composition: Thick Film; Number of Terminations: 2; Max Power Dissipation: 100mW; Features: Automotive AEC-Q200; Length: 0.061inch; Height: 0.022inch; Width: 0.031inch; Radiation Hardening: No; Lead Free: Lead Free; ComponentLink1URL: http://components.arrow.com/part/dataview/50498833S229663N1174?src-supplier=Arrow; ComponentLink1Description: http://components.arrow.com/part/dataview/50498833S229663N1174?src-supplier=Arrow; ComponentLink2URL: https://www.seielect.com/catalog/SEI-Packaging.pdf?src-supplier=Digi-Key; ComponentLink2Description: https://www.seielect.com/catalog/SEI-Packaging.pdf?src-supplier=Digi-Key; ComponentLink3URL: http://www.seielect.com/Catalog/SEI-RMC.pdf?src-supplier=Future+Electronics; ComponentLink3Description: http://www.seielect.com/Catalog/SEI-RMC.pdf?src-supplier=Future+Electronics; ComponentLink4URL: https://www.seielect.com/catalog/SEI-RMCF_RMCP.pdf?src-supplier=Avnet; ComponentLink4Description: https://www.seielect.com/catalog/SEI-RMCF_RMCP.pdf?src-supplier=Avnet; Supplier Part Number 1: RMCF0603FT220RCT-ND; Tolerance: 1%
RR04 = R 3kΩ ±1% 0603 0.1W: as RT01 on sheet KeypadConnection; Supplier 1: Digi-Key; Stock 1: 3150938; Pricing 1: 1=0.1, 10=0.024, 100=0.0097, 1000=0.0044, 2500=0.0038 (USD); Case/Package: 0603; Number of Pins: 2; Case Code (Imperial): 0603; Case Code (Metric): 1608; Min Operating Temperature: -55°C; Max Operating Temperature: 155°C; Packaging: Tape and Reel; Composition: Thick Film; Termination: SMD/SMT; Voltage Rating (DC): 50V; Military Standard: Not; Length: 1.6mm; Width: 800um; Depth: 0.8mm; Lead Free: Lead Free; REACH SVHC: No SVHC; Supplier Part Number 1: 311-3.00KHRCT-ND; Tolerance: 1%
RR05 = RES SMD 1.2K OHM 1% 1/16W 0402: 1.2 kOhms ±1% 0.063W, 1/16W Chip Resistor 0402 (1005 Metric) Moisture Resistant Thick Film; Manufacturer: Yageo; Manufacturer Part Number: RC0402FR-071K2L; Power Rating: 63mW; Voltage Rating: 50V; Temperature Coefficient: 100ppm/°C; Supplier 1: Digi-Key; Stock 1: 894472; Pricing 1: 1=0.1, 10=0.015, 100=0.0062, 1000=0.0028, 2500=0.0024, 5000=0.002 (USD); Case/Package: 0402; Case Code (Imperial): 0402; Case Code (Metric): 1005; Min Operating Temperature: -55°C; Max Operating Temperature: 155°C; Packaging: Tape and Reel; Package Quantity: 1; Termination: SMD/SMT; Composition: Thick Film; Number of Terminations: 2; Military Standard: Not; Max Power Dissipation: 63mW; Features: Moisture Resistant; Length: 1mm; Height: 0.016inch; Width: 0.02inch; Depth: 0.5mm; REACH SVHC: Unknown; Lead Free: Lead Free; ComponentLink1URL: http://www.farnell.com/datasheets/2167052.pdf?src-supplier=Element14; ComponentLink1Description: http://www.farnell.com/datasheets/2167052.pdf?src-supplier=Element14; ComponentLink2URL: https://www.verical.com/server-webapp/html/getDatasheet?partID=323716&src-supplier=Verical; ComponentLink2Description: https://www.verical.com/server-webapp/html/getDatasheet?partID=323716&src-supplier=Verical; ComponentLink3URL: http://documents.rs-components.com/techlib://itc_doclist_GB.htm?stockno=6186138&src-supplier=RSComponents; ComponentLink3Description: http://documents.rs-components.com/techlib://itc_doclist_GB.htm?stockno=6186138&src-supplier=RSComponents; ComponentLink4URL: http://www.yageo.com/documents/recent/PYu-RC_Group_51_RoHS_L_10.pdf?src-supplier=Digi-Key; ComponentLink4Description: http://www.yageo.com/documents/recent/PYu-RC_Group_51_RoHS_L_10.pdf?src-supplier=Digi-Key; ComponentLink5URL: http://www.yageo.com/documents/recent/PYu-RC_Group_51_RoHS_L_9.pdf?src-supplier=Digi-Key; ComponentLink5Description: http://www.yageo.com/documents/recent/PYu-RC_Group_51_RoHS_L_9.pdf?src-supplier=Digi-Key; ComponentLink6URL: http://www.yageo.com/documents/recent/PYu-RC0402_51_RoHS_L_6_r.pdf?src-supplier=Future+Electronics; ComponentLink6Description: http://www.yageo.com/documents/recent/PYu-RC0402_51_RoHS_L_6_r.pdf?src-supplier=Future+Electronics; Supplier Part Number 1: 311-1.20KLRCT-ND; Tolerance: 1%